# Altium project lcd_reverse_engineering_rig.PrjPCB
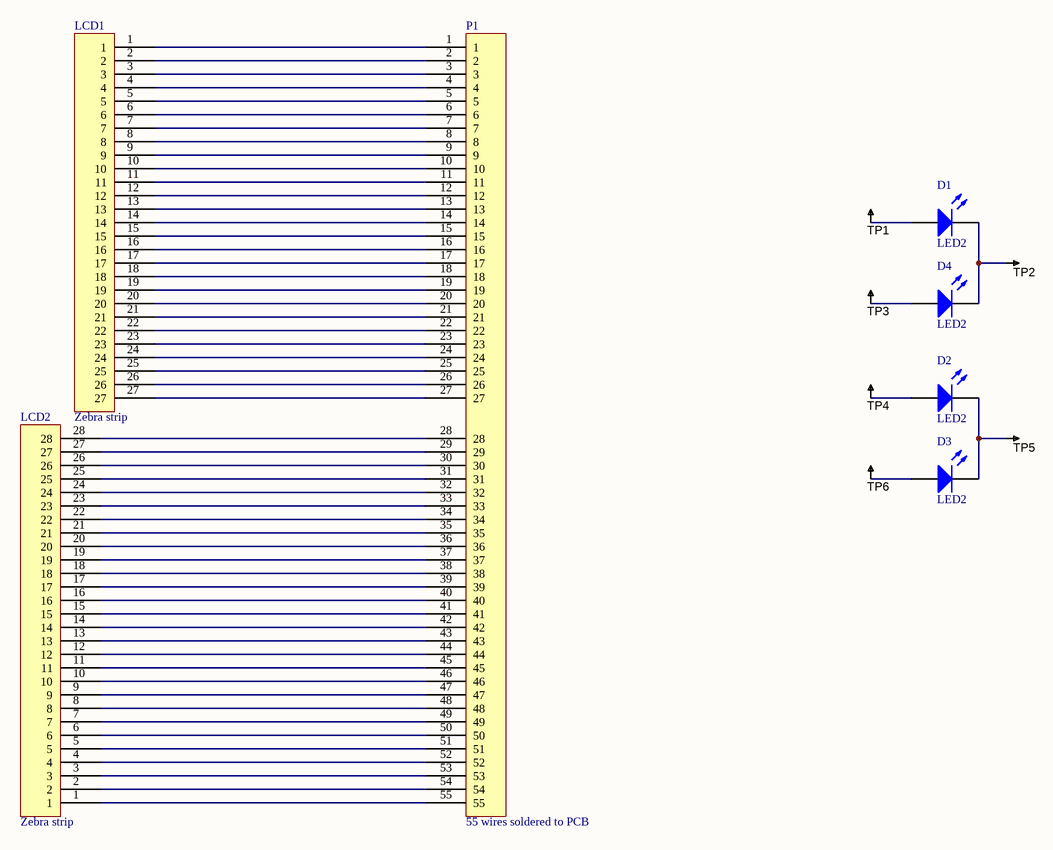
[diagram p0: lcd_reverse_engineering_rig.SchDoc]
1 sheet, 13 parts. Net scope: global (net labels, ports and power ports of the same name join across sheets).
Board file: lcd_reverse_engineering_rig.PcbDoc

## Sheet lcd_reverse_engineering_rig.SchDoc
size A4

### Parts
D1  LED2  [LED_0802_90deg]
D2  LED2  [LED_0802_90deg]
D3  LED2  [LED_0802_90deg]
D4  LED2  [LED_0802_90deg]
LCD1  Zebra strip  [LCD_Connector_27]
LCD2  Zebra strip  [LCD_Connector_28]
P1  55 wires soldered to PCB  [Wires55]
TP1  TESTPOINT_THT_MINI  [THP_D38_T75_B75]  (value not drawn)
TP2  TESTPOINT_THT_MINI  [THP_D38_T75_B75]  (value not drawn)
TP3  TESTPOINT_THT_MINI  [THP_D38_T75_B75]  (value not drawn)
TP4  TESTPOINT_THT_MINI  [THP_D38_T75_B75]  (value not drawn)
TP5  TESTPOINT_THT_MINI  [THP_D38_T75_B75]  (value not drawn)
TP6  TESTPOINT_THT_MINI  [THP_D38_T75_B75]  (value not drawn)

### Nets
NetD1_1: D1.1(A) TP1.1
NetD1_2: D1.2(K) D4.2(K) TP2.1
NetD2_1: D2.1(A) TP4.1
NetD2_2: D2.2(K) D3.2(K) TP5.1
NetD3_1: D3.1(A) TP6.1
NetD4_1: D4.1(A) TP3.1
NetLCD1_1: LCD1.1 P1.1
NetLCD1_2: LCD1.2 P1.2
NetLCD1_3: LCD1.3 P1.3
NetLCD1_4: LCD1.4 P1.4
NetLCD1_5: LCD1.5 P1.5
NetLCD1_6: LCD1.6 P1.6
NetLCD1_7: LCD1.7 P1.7
NetLCD1_8: LCD1.8 P1.8
NetLCD1_9: LCD1.9 P1.9
NetLCD1_10: LCD1.10 P1.10
NetLCD1_11: LCD1.11 P1.11
NetLCD1_12: LCD1.12 P1.12
NetLCD1_13: LCD1.13 P1.13
NetLCD1_14: LCD1.14 P1.14
NetLCD1_15: LCD1.15 P1.15
NetLCD1_16: LCD1.16 P1.16
NetLCD1_17: LCD1.17 P1.17
NetLCD1_18: LCD1.18 P1.18
NetLCD1_19: LCD1.19 P1.19
NetLCD1_20: LCD1.20 P1.20
NetLCD1_21: LCD1.21 P1.21
NetLCD1_22: LCD1.22 P1.22
NetLCD1_23: LCD1.23 P1.23
NetLCD1_24: LCD1.24 P1.24
NetLCD1_25: LCD1.25 P1.25
NetLCD1_26: LCD1.26 P1.26
NetLCD1_27: LCD1.27 P1.27
NetLCD2_1: LCD2.1 P1.55
NetLCD2_2: LCD2.2 P1.54
NetLCD2_3: LCD2.3 P1.53
NetLCD2_4: LCD2.4 P1.52
NetLCD2_5: LCD2.5 P1.51
NetLCD2_6: LCD2.6 P1.50
NetLCD2_7: LCD2.7 P1.49
NetLCD2_8: LCD2.8 P1.48
NetLCD2_9: LCD2.9 P1.47
NetLCD2_10: LCD2.10 P1.46
NetLCD2_11: LCD2.11 P1.45
NetLCD2_12: LCD2.12 P1.44
NetLCD2_13: LCD2.13 P1.43
NetLCD2_14: LCD2.14 P1.42
NetLCD2_15: LCD2.15 P1.41
NetLCD2_16: LCD2.16 P1.40
NetLCD2_17: LCD2.17 P1.39
NetLCD2_18: LCD2.18 P1.38
NetLCD2_19: LCD2.19 P1.37
NetLCD2_20: LCD2.20 P1.36
NetLCD2_21: LCD2.21 P1.35
NetLCD2_22: LCD2.22 P1.34
NetLCD2_23: LCD2.23 P1.33
NetLCD2_24: LCD2.24 P1.32
NetLCD2_25: LCD2.25 P1.31
NetLCD2_26: LCD2.26 P1.30
NetLCD2_27: LCD2.27 P1.29
NetLCD2_28: LCD2.28 P1.28

### Library data of the parts
D1-D4 = LED2: Typical RED, GREEN, YELLOW, AMBER GaAs LED; Published: 8-Jun-2000; LatestRevisionDate: 17-Jul-2002; LatestRevisionNote: Re-released for DXP Platform.; PackageVersion: Feb-2002; PackageReference: 3.2X1.6X1.1; Publisher: Altium Limited; PackageDescription: SM LED; 2 Flat Leads
LCD1 = Zebra strip 27 pin: Zebra strip connector to LCD module (27 pins)
LCD2 = Zebra strip 28 pin: Zebra strip connector to LCD module (28 pins)
P1 = Wires55
TP1-TP6 = TESTPOINT_THT_MINI: Test Point PCB mount Miniature White; PBL Part Number: 3100-567; Manufacturer 1: Keystone Electronics; Manufacturer Part Number 1: 5002; Mounting Type: 0.040" (1.0mm) Hole Diameter; Material: Base, Nylon 46, UL 94V-0; Supplier 1: Digi-Key; Supplier Part Number 1: 5002K-ND